# EAGLE design pu slim crystal (EAGLE 7.6.0)
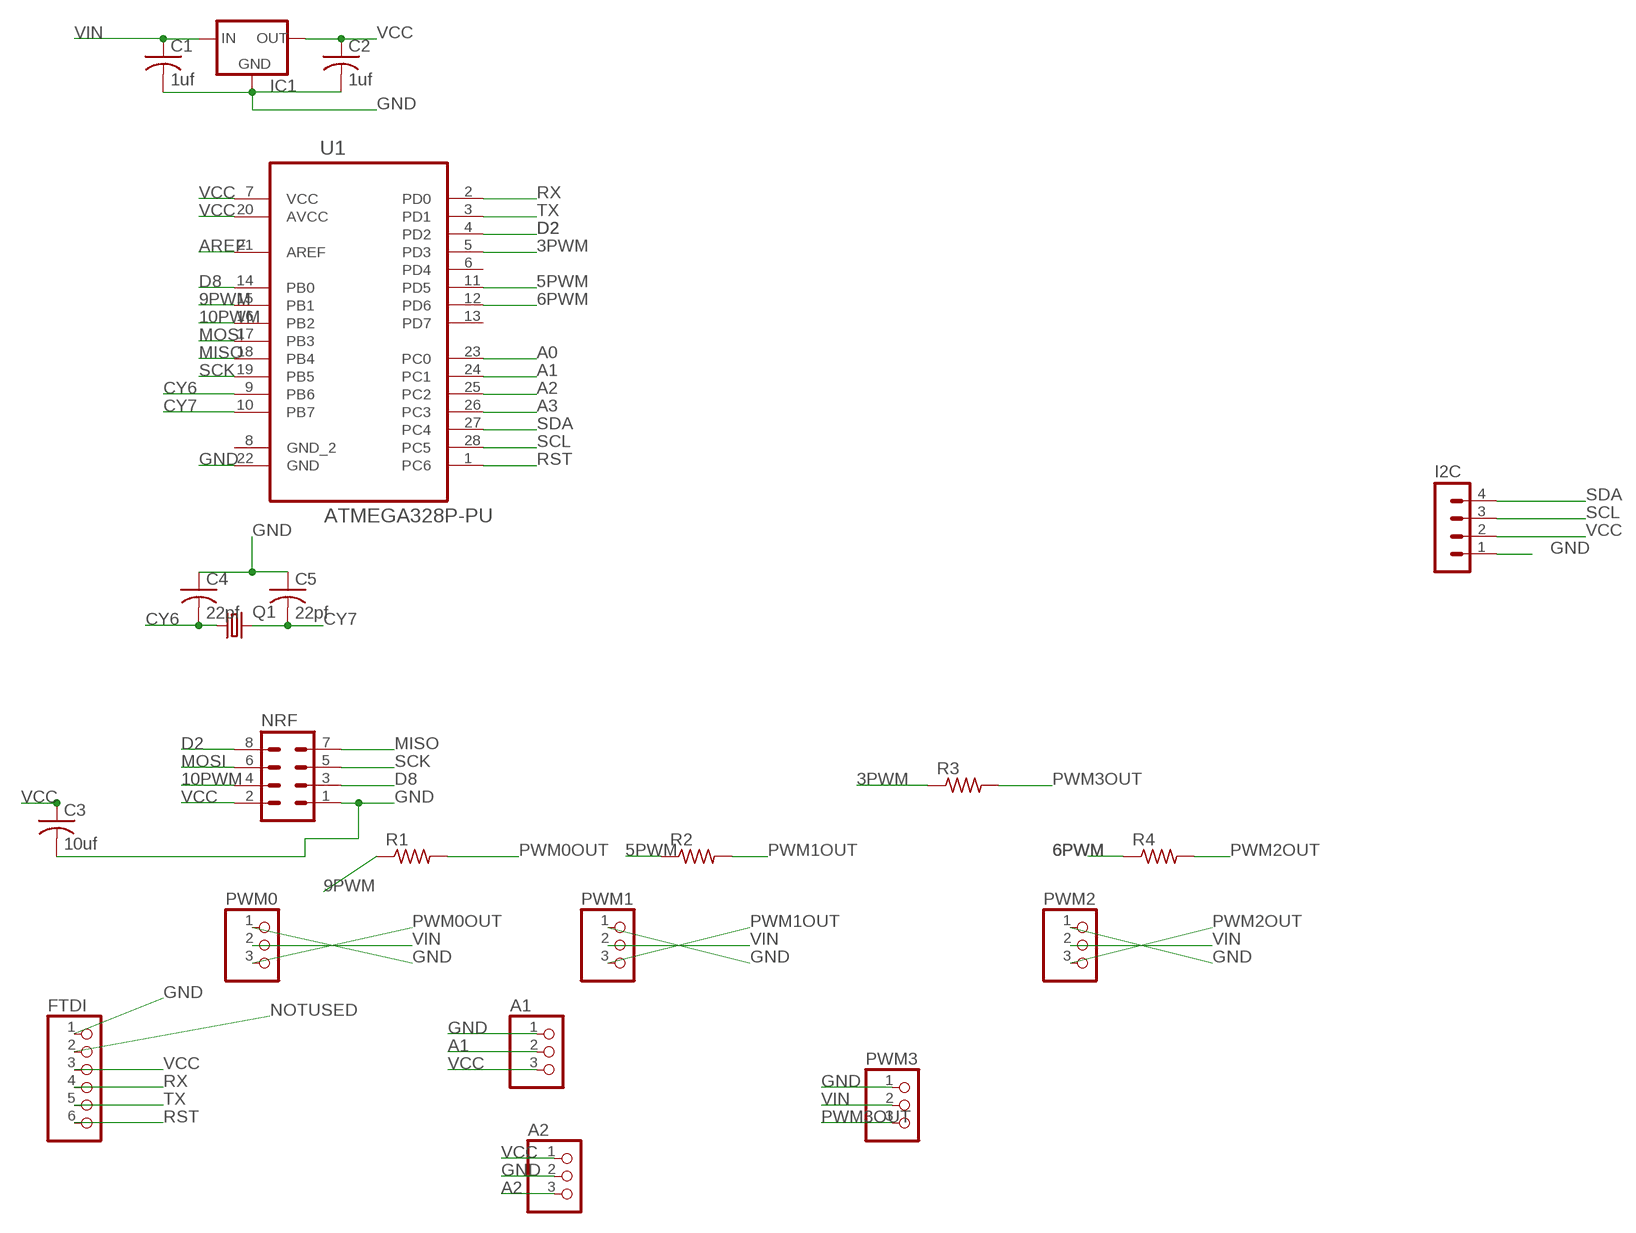
[diagram p0: schematic, sheet 1]

## Parts
A1  PINHD-1X3  [1X03]
A2  PINHD-1X3  [1X03]
C1  1uf  C-US025-025X050  [C025-025X050]
C2  1uf  C-US025-025X050  [C025-025X050]
C3  10uf  C-US025-025X050  [C025-025X050]
C4  22pf  C-US025-025X050  [C025-025X050]
C5  22pf  C-US025-025X050  [C025-025X050]
FTDI  PINHD-1X6CLEAN  [1X06-CLEAN]
I2C  MA04-1  [MA04-1]
IC1  MCP1700TRI  [TO92]
NRF  MA04-2  [MA04-2]
PWM0  PINHD-1X3  [1X03]
PWM1  PINHD-1X3  [1X03]
PWM2  PINHD-1X3  [1X03]
PWM3  PINHD-1X3  [1X03]
Q1  CRYSTALHC49U-V  [HC49U-V]
R1  R-US_0204/7  [0204/7]
R2  R-US_0204/7  [0204/7]
R3  R-US_0204/7  [0204/7]
R4  R-US_0204/7  [0204/7]
U1  ATMEGA328P-PU  [DIP254P762X457-28]

## Nets
3PWM: R3.1 U1.5(PD3)
5PWM: R2.1 U1.11(PD5)
6PWM: R4.1 U1.12(PD6)
9PWM: R1.1 U1.15(PB1)
10PWM: NRF.4 U1.16(PB2)
A0: U1.23(PC0)
A1: A1.2 U1.24(PC1)
A2: A2.3 U1.25(PC2)
A3: U1.26(PC3)
AREF: U1.21(AREF)
CY6: C4.2 Q1.1 U1.9(PB6)
CY7: C5.2 Q1.2 U1.10(PB7)
D2: NRF.8 U1.4(PD2)
D8: NRF.3 U1.14(PB0)
GND: A1.1 A2.2 C1.2 C2.2 C3.2 C4.1 C5.1 FTDI.1 I2C.1 IC1.1(GND) NRF.1 PWM0.1 PWM1.1 PWM2.1 PWM3.1 U1.22(GND)
MISO: NRF.7 U1.18(PB4)
MOSI: NRF.6 U1.17(PB3)
NOTUSED: FTDI.2
PWM0OUT: PWM0.3 R1.2
PWM1OUT: PWM1.3 R2.2
PWM2OUT: PWM2.3 R4.2
PWM3OUT: PWM3.3 R3.2
RST: FTDI.6 U1.1(PC6)
RX: FTDI.4 U1.2(PD0)
SCK: NRF.5 U1.19(PB5)
SCL: I2C.3 U1.28(PC5)
SDA: I2C.4 U1.27(PC4)
TX: FTDI.5 U1.3(PD1)
VCC: A1.3 A2.1 C2.1 C3.1 FTDI.3 I2C.2 IC1.3(OUT) NRF.2 U1.7(VCC) U1.20(AVCC)
VIN: C1.1 IC1.2(IN) PWM0.2 PWM1.2 PWM2.2 PWM3.2
Unconnected: U1.6(PD4) U1.8(GND_2) U1.13(PD7)

## Library data of the parts
A1 A2 PWM0 PWM1-PWM3 = adafruit:PINHD-1X3: PIN HEADER
C1-C5 = adafruit:C-US: CAPACITOR, American symbol
FTDI = adafruit:PINHD-1X6: PIN HEADER
I2C = con-lstb:MA04-1: PIN HEADER; OC_FARNELL: unknown; OC_NEWARK: unknown
IC1 = adafruit:MCP1700: VOLTAGE REGULATOR
NRF = con-lstb:MA04-2: PIN HEADER; OC_FARNELL: unknown; OC_NEWARK: unknown
Q1 = crystal:CRYSTAL: CRYSTAL; OC_FARNELL: 1666969; OC_NEWARK: unknown
R1-R4 = resistor:R-US_: RESISTOR, American symbol
U1 = Atmel_By_element14_Batch_1-00:ATMEGA328P-PU: 8-bit Microcontroller with In-System Programmable Flash; MPN: ATMEGA328P-PU; OC_FARNELL: 1715487; OC_NEWARK: 15R0268; PACKAGE: PDIP-28; SUPPLIER: Atmel

## Board
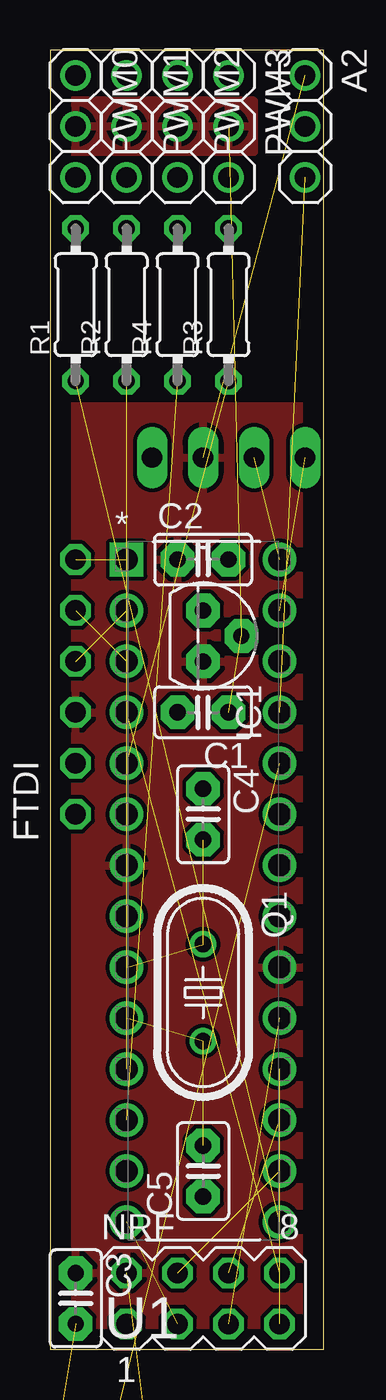
[diagram p1: board, top side]
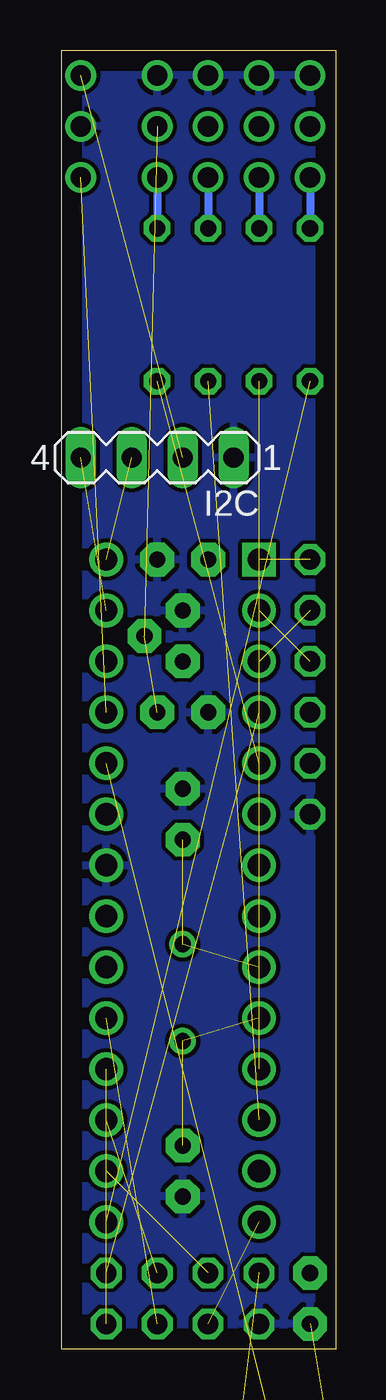
[diagram p2: board, bottom side, seen from below]

Size 13.64 x 64.76 mm. Coordinates in mm from the lower left corner, seen from the top.
Outline: 0,0 13.64,0 13.64,64.76 0,64.76 0,0
Copper layers (1*16): Top 0.035mm / dielectric 1.5mm / Bottom 0.035mm
Design rules "default": minimum track width 10mil, minimum drill 24mil, track to track 8mil, track to pad 8mil, pad to pad 8mil, via to via 8mil, smd to smd 8mil, copper to edge 40mil, drill to drill 8mil, minimum pad ring 10mil, minimum via ring 8mil, stop-mask expansion 4mil, vias tented up to drill 0mil, thermal gap 10mil

### Footprints (pad centres in the part's own frame; a part is rotated, then mirrored left to right if it is on the bottom)
1X03 = drill 1.016: 1 -2.54,0; 2 0,0; 3 2.54,0
C025-025X050 = drill 0.813 pad 1.676 octagon: 1 -1.27,0; 2 1.27,0
1X06-CLEAN = drill 1.016 octagon: 1 -6.35,0; 2 -3.81,0; 3 -1.27,0; 4 1.27,0; 5 3.81,0; 6 6.35,0
MA04-1 = drill 1.016 long: 1 -3.81,0; 2 -1.27,0; 3 1.27,0; 4 3.81,0
TO92 = drill 0.813 pad 1.676 octagon: 1 -1.27,0; 2 0,1.905; 3 1.27,0
MA04-2 = drill 1.016 octagon: 1 -3.81,-1.27; 2 -3.81,1.27; 3 -1.27,-1.27; 4 -1.27,1.27; 5 1.27,-1.27; 6 1.27,1.27; 7 3.81,-1.27; 8 3.81,1.27
HC49U-V = drill 0.813: 1 -2.413,0; 2 2.413,0
0204/7 = drill 0.813 octagon: 1 -3.81,0; 2 3.81,0
DIP254P762X457-28 = drill 1.118 square: 1 -7.62,33.02 | drill 1.118: 2 -7.62,30.48; 3 -7.62,27.94; 4 -7.62,25.4; 5 -7.62,22.86; 6 -7.62,20.32; 7 -7.62,17.78; 8 -7.62,15.24; 9 -7.62,12.7; 10 -7.62,10.16; 11 -7.62,7.62; 12 -7.62,5.08; 13 -7.62,2.54; 14 -7.62,0; 15 0,0; 16 0,2.54; 17 0,5.08; 18 0,7.62; 19 0,10.16; 20 0,12.7; 21 0,15.24; 22 0,17.78; 23 0,20.32; 24 0,22.86; 25 0,25.4; 26 0,27.94; 27 0,30.48; 28 0,33.02

### Placement (x,y rotation side)
A1  2.54,-6.35 0 top  (outside the outline)
A2  12.7,60.96 270 top
C1  7.62,31.75 180 top
C2  7.62,39.37 0 top
C3  1.27,2.54 270 top
C4  7.62,26.67 270 top
C5  7.62,8.89 90 top
FTDI  1.27,33.02 90 top
I2C  8.89,44.45 180 bottom
IC1  7.62,35.56 270 top
NRF  7.62,2.54 0 top
PWM0  1.27,60.96 270 top
PWM1  3.81,60.96 270 top
PWM2  6.35,60.96 270 top
PWM3  8.89,60.96 270 top
Q1  7.62,17.78 270 top
R1  1.27,52.07 90 top
R2  3.81,52.07 90 top
R3  8.89,52.07 90 top
R4  6.35,52.07 90 top
U1  11.43,6.35 0 top

### Tracks (layer width: path | path; a pad name or v marks a point on that pad's centre or on a via)
3PWM  (1 unrouted)
5PWM  (1 unrouted)
6PWM  (1 unrouted)
9PWM  (1 unrouted)
10PWM  (1 unrouted)
A1  (1 unrouted)
A2  (1 unrouted)
CY6  (2 unrouted)
CY7  (2 unrouted)
D2  (1 unrouted)
D8  (1 unrouted)
GND  (1 unrouted)
  pour Bottom: 0,64.77 0,0 16.51,0 16.51,64.77
MISO  (1 unrouted)
MOSI  (1 unrouted)
PWM0OUT
  Bottom 0.406: PWM0.3 R1.2
PWM1OUT
  Bottom 0.406: PWM1.3 R2.2
PWM2OUT
  Bottom 0.406: PWM2.3 R4.2
PWM3OUT
  Bottom 0.406: PWM3.3 R3.2
RST  (1 unrouted)
RX  (1 unrouted)
SCK  (1 unrouted)
SCL  (1 unrouted)
SDA  (1 unrouted)
TX  (1 unrouted)
VCC  (2 unrouted)
  pour Top: 0,-1.27 16.51,-1.27 16.51,46.99 0,46.99
VIN  (2 unrouted)
  pour Top: 0,62.23 0,59.69 10.16,59.69 10.16,60.96 10.16,62.23